# Altium schematic sheet 3_IO_Module.SchDoc
size A; SheetNumber: 3; SheetTotal: 5
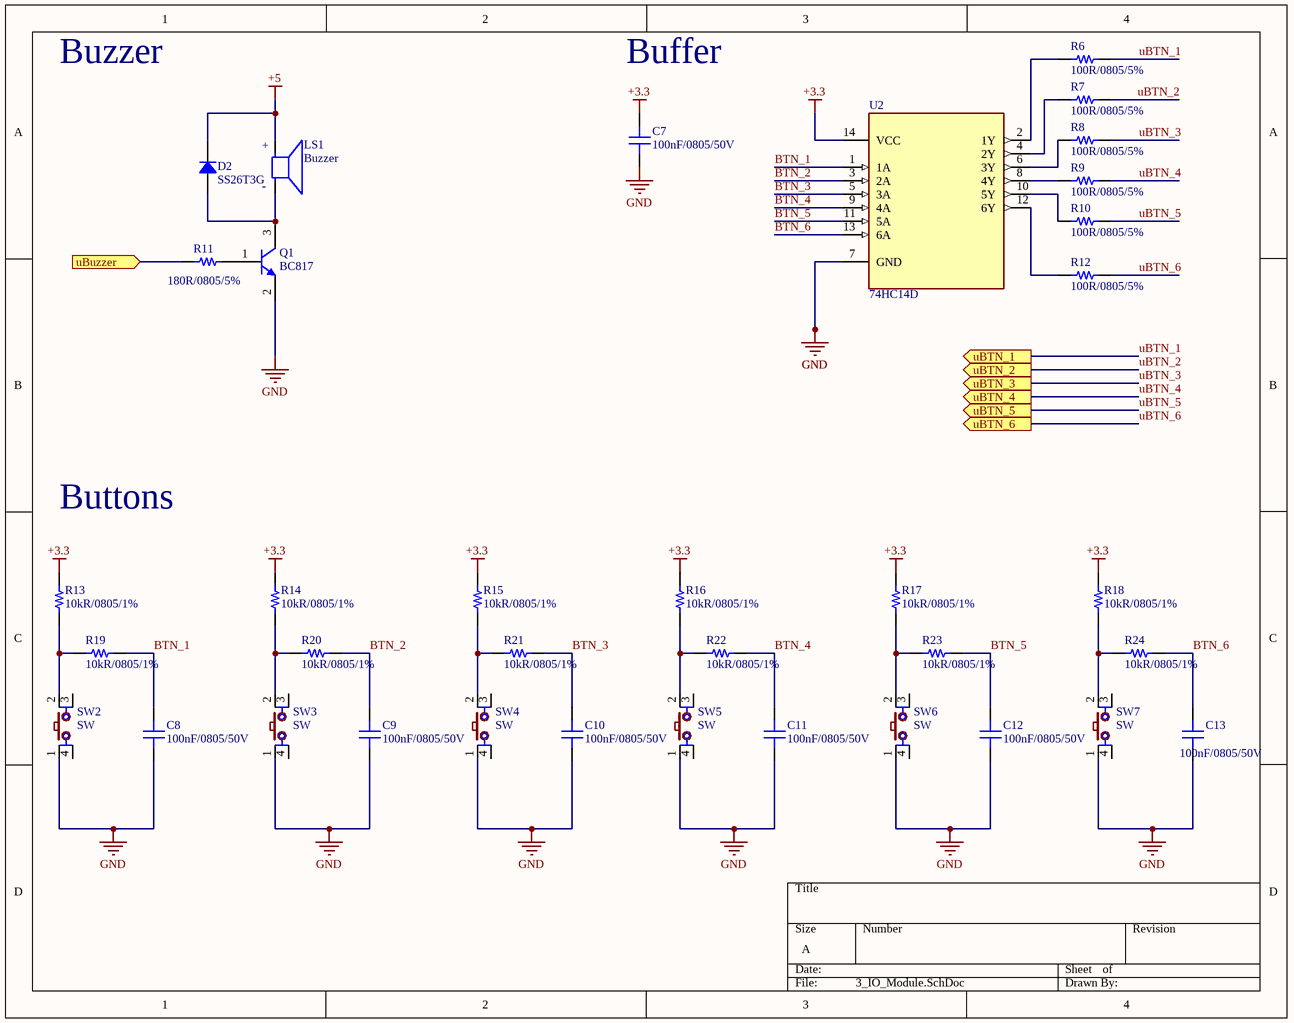
[diagram p0: 3_IO_Module.SchDoc]

## Parts
C7  100nF/0805/50V  [CAP FILM 0805]
C8  100nF/0805/50V  [CAP FILM 0805]
C9  100nF/0805/50V  [CAP FILM 0805]
C10  100nF/0805/50V  [CAP FILM 0805]
C11  100nF/0805/50V  [CAP FILM 0805]
C12  100nF/0805/50V  [CAP FILM 0805]
C13  100nF/0805/50V  [CAP FILM 0805]
D2  SS26T3G  [ST DO214AC SMA]
LS1  Buzzer  [XDCR_AT-1224-TWT-5V-2-R]
Q1  BC817  [TI SOT-23-3 DBZ]
R6  100R/0805/5%  [RES 0805_2012]
R7  100R/0805/5%  [RES 0805_2012]
R8  100R/0805/5%  [RES 0805_2012]
R9  100R/0805/5%  [RES 0805_2012]
R10  100R/0805/5%  [RES 0805_2012]
R11  180R/0805/5%  [RES 0805_2012]
R12  100R/0805/5%  [RES 0805_2012]
R13  10kR/0805/1%  [RES 0805_2012]
R14  10kR/0805/1%  [RES 0805_2012]
R15  10kR/0805/1%  [RES 0805_2012]
R16  10kR/0805/1%  [RES 0805_2012]
R17  10kR/0805/1%  [RES 0805_2012]
R18  10kR/0805/1%  [RES 0805_2012]
R19  10kR/0805/1%  [RES 0805_2012]
R20  10kR/0805/1%  [RES 0805_2012]
R21  10kR/0805/1%  [RES 0805_2012]
R22  10kR/0805/1%  [RES 0805_2012]
R23  10kR/0805/1%  [RES 0805_2012]
R24  10kR/0805/1%  [RES 0805_2012]
SW2  SW  [SW2-SMD]
SW3  SW  [SW2-SMD]
SW4  SW  [SW2-SMD]
SW5  SW  [SW2-SMD]
SW6  SW  [SW2-SMD]
SW7  SW  [SW2-SMD]
U2  74HC14D  [SOIC127P600X175-14N]

## Ports
uBTN_1 (out), uBTN_2 (out), uBTN_3 (out), uBTN_4 (out), uBTN_5 (out), uBTN_6 (out), uBuzzer (in)

## Nets
+3.3: C7.2 R13.2 R14.2 R15.2 R16.2 R17.2 R18.2 U2.14(VCC)
+5: D2.2 LS1.P
GND: C7.1 C8.1 C9.1 C10.1 C11.1 C12.1 C13.1 Q1.2(E) SW2.1 SW3.1 SW4.1 SW5.1 SW6.1 SW7.1 U2.7(GND)
BTN_1: C8.2 R19.1 U2.1(1A)
BTN_2: C9.2 R20.1 U2.3(2A)
BTN_3: C10.2 R21.1 U2.5(3A)
BTN_4: C11.2 R22.1 U2.9(4A)
BTN_5: C12.2 R23.1 U2.11(5A)
BTN_6: C13.2 R24.1 U2.13(6A)
uBTN_1: R6.2 ; port uBTN_1
uBTN_2: R7.2 ; port uBTN_2
uBTN_3: R8.2 ; port uBTN_3
uBTN_4: R9.2 ; port uBTN_4
uBTN_5: R10.2 ; port uBTN_5
uBTN_6: R12.2 ; port uBTN_6
uBuzzer: R11.2 ; port uBuzzer
NetD2_1: D2.1 LS1.N Q1.3(C)
NetQ1_1: Q1.1(B) R11.1
NetR6_1: R6.1 U2.2(1Y)
NetR7_1: R7.1 U2.4(2Y)
NetR8_1: R8.1 U2.6(3Y)
NetR9_1: R9.1 U2.8(4Y)
NetR10_1: R10.1 U2.10(5Y)
NetR12_1: R12.1 U2.12(6Y)
NetR13_1: R13.1 R19.2 SW2.2
NetR14_1: R14.1 R20.2 SW3.2
NetR15_1: R15.1 R21.2 SW4.2
NetR16_1: R16.1 R22.2 SW5.2
NetR17_1: R17.1 R23.2 SW6.2
NetR18_1: R18.1 R24.2 SW7.2

Not connected (* = marked no-connect by the designer): SW2 3 4; SW3 3 4; SW4 3 4; SW5 3 4; SW6 3 4; SW7 3 4

## Notes on the sheet
- Buzzer
- Buffer
- Buttons
- (in symbol AT-1224-TWT-5V-2-R) +; -

## Library data of the parts
C7-C13 = Capacitor - MLCC: Multilayer Ceramic Capacitor, 0.1 uF, 50 V, ï¿½ 10%, X7R, 0805 [2012 Metric]; Manufacturer: Samsung; Manufacturer Part Number: CL21B104KBCNNNC; Capacitance: 100nF; Voltage Rating: 50V; Supplier 1: Avnet; Supplier Part Number 1: CL21B104KBCNNNC; RoHS: Yes; Category: Ceramic Capacitors; Stock 1: 850000; Pricing 1: 4000=0.0097, 8000=0.00455, 16000=0.00444, 24000=0.00434, 32000=0.00423 (USD); Mount: Surface Mount; Case/Package: 0805; Case Code (Metric): 2012; Case Code (Imperial): 0805; Material: Ceramic; Min Operating Temperature: -55°C; Max Operating Temperature: 125°C; Tolerance: 10%; Dielectric: X7R; Packaging: Tape and Reel; Voltage: 50V; Series: CL; Construction: Flat; Voltage Rating (DC): 50V; Length: 2mm; Width: 0.049inch; Height: 0.85mm; Depth: 1.25mm; Thickness: 0.037inch; Radiation Hardening: No; RoHS Compliant: Yes; Lead Free: 5697LeadFree; ComponentLink1URL: https://datasheet.ciiva.com/25710/cl21b104kbcnnnc-25710182.pdf?src-supplier=Digikey; ComponentLink1Description: https://datasheet.ciiva.com/25710/cl21b104kbcnnnc-25710182.pdf?src-supplier=Digikey; ComponentLink2URL: https://datasheet.ciiva.com/29199/454152-da-01-en-vs-kondensator-0805-29199814.pdf?src-supplier=Conrad; ComponentLink2Description: https://datasheet.ciiva.com/29199/454152-da-01-en-vs-kondensator-0805-29199814.pdf?src-supplier=Conrad
D2 = Diode: VR=60V IF=2A; Manufacturer: ON Semiconductor; Supplier 1: Future Electronics; Supplier Part Number 1: 2177327; Manufacturer Part Number: SS26T3G; RoHS: Yes; Category: Schottky Diodes; Stock 1: 680000; Pricing 1: 2500=0.0916, 5000=0.0892, 7500=0.0878, 12500=0.0861, 25000=0.0826 (USD); ComponentLink1URL: https://datasheet.ciiva.com/915/ss26-d-915744.pdf?src-supplier=Avnet; ComponentLink1Description: https://datasheet.ciiva.com/915/ss26-d-915744.pdf?src-supplier=Avnet; ComponentLink2URL: https://datasheet.ciiva.com/915/ss26-d-915744.pdf?src-supplier=Digikey; ComponentLink2Description: https://datasheet.ciiva.com/915/ss26-d-915744.pdf?src-supplier=Digikey; ComponentLink3URL: https://datasheet.ciiva.com/4715/ss26-d-116950-4715414.pdf?src-supplier=Mouser; ComponentLink3Description: https://datasheet.ciiva.com/4715/ss26-d-116950-4715414.pdf?src-supplier=Mouser; ComponentLink4URL: https://datasheet.ciiva.com/30479/0900766b811a65f7-30479444.pdf?src-supplier=Rs; ComponentLink4Description: https://datasheet.ciiva.com/30479/0900766b811a65f7-30479444.pdf?src-supplier=Rs; ComponentLink5URL: https://datasheet.ciiva.com/8292/ss26-d-8292426.pdf?src-supplier=Avnet; ComponentLink5Description: https://datasheet.ciiva.com/8292/ss26-d-8292426.pdf?src-supplier=Avnet; ComponentLink6URL: https://datasheet.ciiva.com/915/ss26-d-915745.pdf?src-supplier=Digikey; ComponentLink6Description: https://datasheet.ciiva.com/915/ss26-d-915745.pdf?src-supplier=Digikey; ComponentLink7URL: https://datasheet.ciiva.com/17011/70275469-17011591.pdf?src-supplier=Allied+Electronics; ComponentLink7Description: https://datasheet.ciiva.com/17011/70275469-17011591.pdf?src-supplier=Allied+Electronics; ComponentLink8URL: https://datasheet.ciiva.com/16206/ss26-d-16206477.pdf?src-supplier=Future+Electronics; ComponentLink8Description: https://datasheet.ciiva.com/16206/ss26-d-16206477.pdf?src-supplier=Future+Electronics
LS1 = AT-1224-TWT-5V-2-R: AUDIO TRANSDUCER 12 VP-P 85 DB 2400 HZ; Package: None; Price: None; Value: *; MP: AT-1224-TWT-5V-2-R; Availability: Unavailable
Q1 = BJT NPN
R6-R10 R12 = Resistor: SMD Chip Resistor, 100 Ohm, ± 5%, 125 mW, 0805 [2012 Metric], Thick Film, General Purpose; Manufacturer: Yageo; Manufacturer Part Number: AC0805JR-07100RL; Resistance: 100R; Supplier 1: Future Electronics; Supplier Part Number 1: 4083153; RoHS: Yes; Category: Chip SMD Resistors; Stock 1: 295000; Pricing 1: 5000=0.004, 25000=0.0038, 100000=0.0037, 250000=0.0036, 625000=0.0034 (USD); ComponentLink1URL: http://www.mouser.com/ds/2/447/yageodocoutput-1111992.pdf?src-supplier=Mouser; ComponentLink1Description: http://www.mouser.com/ds/2/447/yageodocoutput-1111992.pdf?src-supplier=Mouser; ComponentLink2URL: https://www.yageo.com/upload/media/product/productsearch/datasheet/rchip/PYu-AC_51_RoHS_L_7.pdf?src-supplier=Digikey; ComponentLink2Description: https://www.yageo.com/upload/media/product/productsearch/datasheet/rchip/PYu-AC_51_RoHS_L_7.pdf?src-supplier=Digikey; ComponentLink3URL: http://www.yageo.com/NewPortal/yageodocoutput?fileName=/pdf/R-Chip/PYu-AC_51_RoHS_L_6.pdf&src-supplier=Digikey; ComponentLink3Description: http://www.yageo.com/NewPortal/yageodocoutput?fileName=/pdf/R-Chip/PYu-AC_51_RoHS_L_6.pdf&src-supplier=Digikey; ComponentLink4URL: https://datasheet.octopart.com/AC0805JR-07100RL-Yageo-datasheet-151884373.pdf?src-supplier=Future+Electronics; ComponentLink4Description: https://datasheet.octopart.com/AC0805JR-07100RL-Yageo-datasheet-151884373.pdf?src-supplier=Future+Electronics; Case/Package: 0805; Tolerance: 5%
R11 = Resistor: Anti-Sulfurated Chip Resistor Thick Film 0805 180Ohm 1% Paper T/R; Manufacturer: Yageo; Manufacturer Part Number: AF0805FR-07180RL; Power Rating: 125mW; Resistance: 180R; Temperature Coefficient: 100ppm/°C; Voltage Rating: 150V; Tolerance: 5%; Supplier 1: Digikey; Supplier Part Number 1: 13-AF0805FR-07180RL-ND; RoHS: Yes; Category: Chip SMD Resistors; Pricing 1: 5000=0.0153 (USD); Case/Package: 0805; Min Operating Temperature: -55°C; Max Operating Temperature: 155°C; Packaging: 10Packaging; Height: 600um
R13-R24 = Resistor: SMD Chip Resistor, 10 kOhm, ï¿½ 1%, 125 mW, 0805 [2012 Metric], Thick Film, General Purpose; Manufacturer: Yageo; Manufacturer Part Number: RC0805FR-0710KL; Resistance: 10kR; Temperature Coefficient: 100ppm/°C; Power Rating: 125mW; Voltage Rating: 150V; Supplier 1: Future Electronics; Supplier Part Number 1: 3310877; RoHS: Yes; Category: Chip SMD Resistors; Stock 1: 3290000; Pricing 1: 5000=0.0035, 25000=0.0034, 100000=0.0032, 250000=0.0032, 625000=0.003 (USD); Case/Package: 0805; Case Code (Imperial): 0805; Case Code (Metric): 2012; Size Code: 0805; Min Operating Temperature: -55°C; Max Operating Temperature: 155°C; Tolerance: 1%; Packaging: Tape and Reel; Resistor Type: Thick Film; Package Quantity: 1; Termination: SMD/SMT; Number of Terminations: 2; Max Power Dissipation: 125mW; Features: Moisture Resistant; Series: RC; Construction: Rectangular; Resistance Tolerance: 1%; Technology: THICK FILM; Length: 0.079inch; Width: 0.049inch; Height: 0.024inch; Depth: 1.25mm; Reach SVHC Compliant: Unknown; Lead Free: Lead Free; Military Standard: Not; RoHS Compliant: Yes
SW2-SW7 = SW4: Switch button 4 pin; Value: Button chip 4 pin
U2 = 74HC14D: Inverter IC 6 Channel Schmitt Trigger 14-SOIC; MF: Toshiba; SnapEDA_Link: https://www.snapeda.com/parts/74HC14D/Toshiba+Semiconductor+and+Storage/view-part/?ref=snap; Availability: In Stock; Price: None; Package: SO14-14 Nexperia USA Inc.; Purchase-URL: https://pricing.snapeda.com/search/part/74HC14D/?ref=eda; Check_prices: https://www.snapeda.com/parts/74HC14D/Toshiba+Semiconductor+and+Storage/view-part/?ref=eda; Value: *; MP: 74HC14D